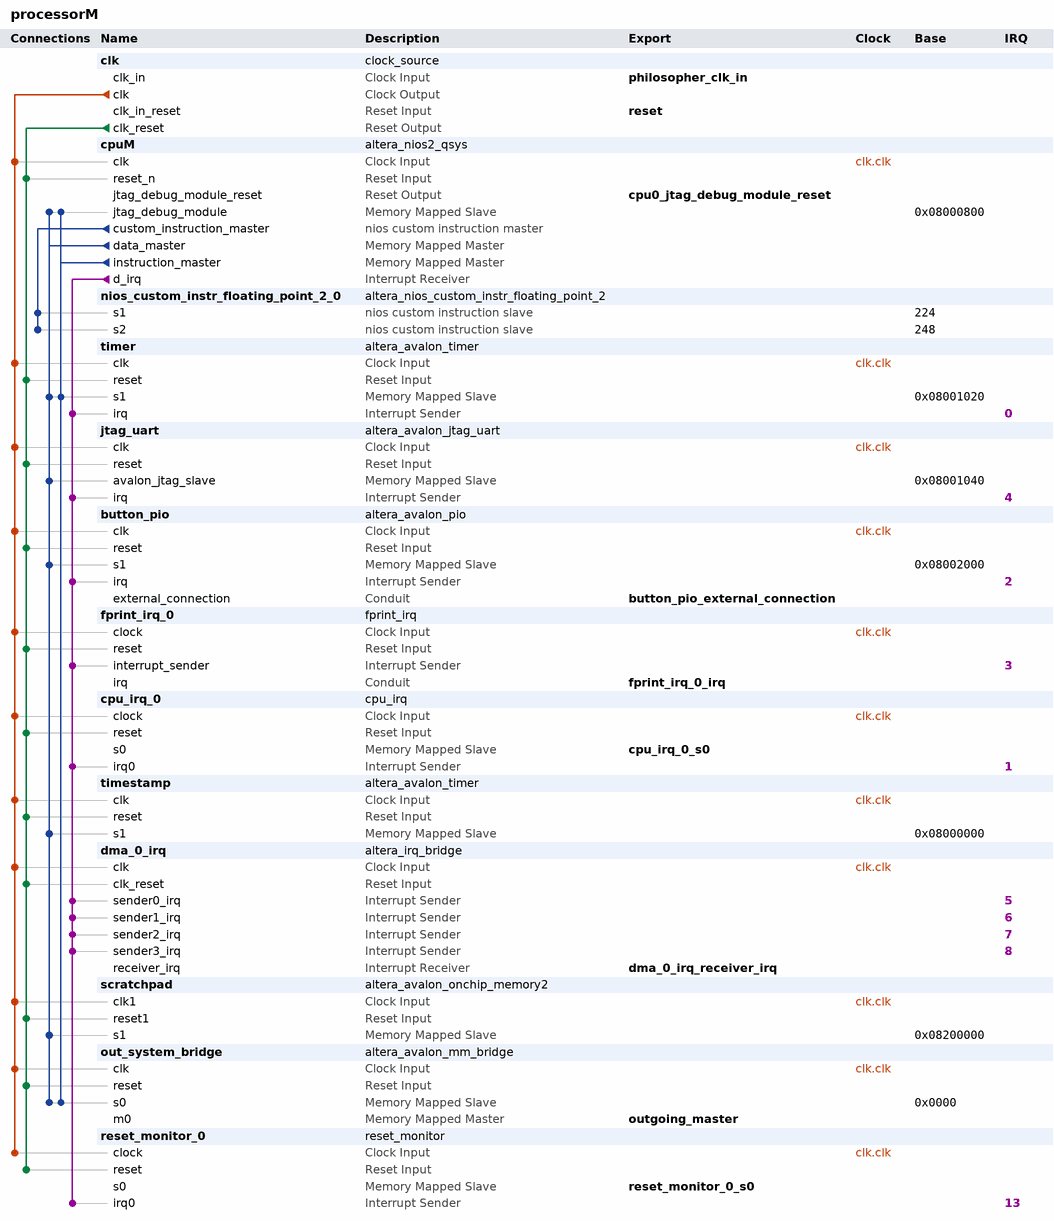
[diagram p0: system contents]
# Platform Designer (Qsys) system processorM, Arria V 5AGXFB3H4F35C5
# Parameters at their usual value, and those the tool derives, are not listed.
package require -exact qsys 13.1
create_system processorM
set_project_property DEVICE_FAMILY {Arria V}
set_project_property DEVICE 5AGXFB3H4F35C5

add_instance clk clock_source 13.1
set_instance_parameter_value clk clockFrequency 50000000

add_instance cpuM altera_nios2_qsys 13.1
set_instance_parameter_value cpuM mpu_enabled true
set_instance_parameter_value cpuM mpu_numOfDataRegion 16
set_instance_parameter_value cpuM resetOffset 4194304
set_instance_parameter_value cpuM exceptionOffset 4194336
set_instance_parameter_value cpuM cpuID 9
set_instance_parameter_value cpuM resetSlave Absolute
set_instance_parameter_value cpuM exceptionSlave Absolute
set_instance_parameter_value cpuM breakSlave cpuM.jtag_debug_module
set_instance_parameter_value cpuM muldiv_multiplierType NoneSmall
set_instance_parameter_value cpuM mpu_minDataRegionSize 10
set_instance_parameter_value cpuM impl Fast
set_instance_parameter_value cpuM icache_size 1024
set_instance_parameter_value cpuM dcache_size 0

add_instance nios_custom_instr_floating_point_2_0 altera_nios_custom_instr_floating_point_2 100.99.98.97

add_instance timer altera_avalon_timer 13.1
set_instance_parameter_value timer period 1
set_instance_parameter_value timer periodUnits MSEC

add_instance jtag_uart altera_avalon_jtag_uart 13.1
set_instance_parameter_value jtag_uart simInteractiveOptions INTERACTIVE_ASCII_OUTPUT

add_instance button_pio altera_avalon_pio 13.1
set_instance_parameter_value button_pio bitClearingEdgeCapReg true
set_instance_parameter_value button_pio captureEdge true
set_instance_parameter_value button_pio direction Input
set_instance_parameter_value button_pio generateIRQ true
set_instance_parameter_value button_pio irqType EDGE
set_instance_parameter_value button_pio width 1

add_instance fprint_irq_0 fprint_irq 1.0

add_instance cpu_irq_0 cpu_irq 1.0

add_instance timestamp altera_avalon_timer 13.1
set_instance_parameter_value timestamp counterSize 64
set_instance_parameter_value timestamp period 1
set_instance_parameter_value timestamp periodUnits MSEC

add_instance dma_0_irq altera_irq_bridge 13.1
set_instance_parameter_value dma_0_irq IRQ_WIDTH 4

add_instance scratchpad altera_avalon_onchip_memory2 13.1
set_instance_parameter_value scratchpad dataWidth 32
set_instance_parameter_value scratchpad dualPort false
set_instance_parameter_value scratchpad initMemContent true
set_instance_parameter_value scratchpad initializationFileName onchip_mem.hex
set_instance_parameter_value scratchpad memorySize 16384

add_instance out_system_bridge altera_avalon_mm_bridge 13.1
set_instance_parameter_value out_system_bridge DATA_WIDTH 32
set_instance_parameter_value out_system_bridge ADDRESS_WIDTH 27
set_instance_parameter_value out_system_bridge ADDRESS_UNITS SYMBOLS
set_instance_parameter_value out_system_bridge MAX_PENDING_RESPONSES 4

add_instance reset_monitor_0 reset_monitor 1.0

# connections
add_connection clk.clk button_pio.clk clock
add_connection clk.clk cpu_irq_0.clock clock
add_connection clk.clk cpuM.clk clock
add_connection clk.clk dma_0_irq.clk clock
add_connection clk.clk fprint_irq_0.clock clock
add_connection clk.clk jtag_uart.clk clock
add_connection clk.clk out_system_bridge.clk clock
add_connection clk.clk reset_monitor_0.clock clock
add_connection clk.clk scratchpad.clk1 clock
add_connection clk.clk timer.clk clock
add_connection clk.clk timestamp.clk clock
add_connection clk.clk_reset button_pio.reset reset
add_connection clk.clk_reset cpu_irq_0.reset reset
add_connection clk.clk_reset cpuM.reset_n reset
add_connection clk.clk_reset dma_0_irq.clk_reset reset
add_connection clk.clk_reset fprint_irq_0.reset reset
add_connection clk.clk_reset jtag_uart.reset reset
add_connection clk.clk_reset out_system_bridge.reset reset
add_connection clk.clk_reset reset_monitor_0.reset reset
add_connection clk.clk_reset scratchpad.reset1 reset
add_connection clk.clk_reset timer.reset reset
add_connection clk.clk_reset timestamp.reset reset
add_connection cpuM.data_master button_pio.s1 avalon
set_connection_parameter_value cpuM.data_master/button_pio.s1 baseAddress 0x08002000
add_connection cpuM.data_master cpuM.jtag_debug_module avalon
set_connection_parameter_value cpuM.data_master/cpuM.jtag_debug_module baseAddress 0x08000800
add_connection cpuM.data_master jtag_uart.avalon_jtag_slave avalon
set_connection_parameter_value cpuM.data_master/jtag_uart.avalon_jtag_slave baseAddress 0x08001040
add_connection cpuM.data_master out_system_bridge.s0 avalon
set_connection_parameter_value cpuM.data_master/out_system_bridge.s0 arbitrationPriority 8
set_connection_parameter_value cpuM.data_master/out_system_bridge.s0 baseAddress 0x0000
add_connection cpuM.data_master scratchpad.s1 avalon
set_connection_parameter_value cpuM.data_master/scratchpad.s1 baseAddress 0x08200000
add_connection cpuM.data_master timer.s1 avalon
set_connection_parameter_value cpuM.data_master/timer.s1 baseAddress 0x08001020
add_connection cpuM.data_master timestamp.s1 avalon
set_connection_parameter_value cpuM.data_master/timestamp.s1 baseAddress 0x08000000
add_connection cpuM.instruction_master cpuM.jtag_debug_module avalon
set_connection_parameter_value cpuM.instruction_master/cpuM.jtag_debug_module baseAddress 0x08000800
add_connection cpuM.instruction_master out_system_bridge.s0 avalon
set_connection_parameter_value cpuM.instruction_master/out_system_bridge.s0 arbitrationPriority 8
set_connection_parameter_value cpuM.instruction_master/out_system_bridge.s0 baseAddress 0x0000
add_connection cpuM.instruction_master timer.s1 avalon
set_connection_parameter_value cpuM.instruction_master/timer.s1 baseAddress 0x08001020
add_connection cpuM.d_irq button_pio.irq interrupt
set_connection_parameter_value cpuM.d_irq/button_pio.irq irqNumber 2
add_connection cpuM.d_irq cpu_irq_0.irq0 interrupt
set_connection_parameter_value cpuM.d_irq/cpu_irq_0.irq0 irqNumber 1
add_connection cpuM.d_irq dma_0_irq.sender0_irq interrupt
set_connection_parameter_value cpuM.d_irq/dma_0_irq.sender0_irq irqNumber 5
add_connection cpuM.d_irq dma_0_irq.sender1_irq interrupt
set_connection_parameter_value cpuM.d_irq/dma_0_irq.sender1_irq irqNumber 6
add_connection cpuM.d_irq dma_0_irq.sender2_irq interrupt
set_connection_parameter_value cpuM.d_irq/dma_0_irq.sender2_irq irqNumber 7
add_connection cpuM.d_irq dma_0_irq.sender3_irq interrupt
set_connection_parameter_value cpuM.d_irq/dma_0_irq.sender3_irq irqNumber 8
add_connection cpuM.d_irq fprint_irq_0.interrupt_sender interrupt
set_connection_parameter_value cpuM.d_irq/fprint_irq_0.interrupt_sender irqNumber 3
add_connection cpuM.d_irq jtag_uart.irq interrupt
set_connection_parameter_value cpuM.d_irq/jtag_uart.irq irqNumber 4
add_connection cpuM.d_irq reset_monitor_0.irq0 interrupt
set_connection_parameter_value cpuM.d_irq/reset_monitor_0.irq0 irqNumber 13
add_connection cpuM.d_irq timer.irq interrupt
set_connection_parameter_value cpuM.d_irq/timer.irq irqNumber 0
add_connection cpuM.custom_instruction_master nios_custom_instr_floating_point_2_0.s1 nios_custom_instruction
set_connection_parameter_value cpuM.custom_instruction_master/nios_custom_instr_floating_point_2_0.s1 CIName nios_custom_instr_floating_point_2_0
set_connection_parameter_value cpuM.custom_instruction_master/nios_custom_instr_floating_point_2_0.s1 baseAddress 224
add_connection cpuM.custom_instruction_master nios_custom_instr_floating_point_2_0.s2 nios_custom_instruction
set_connection_parameter_value cpuM.custom_instruction_master/nios_custom_instr_floating_point_2_0.s2 CIName nios_custom_instr_floating_point_2_0_1
set_connection_parameter_value cpuM.custom_instruction_master/nios_custom_instr_floating_point_2_0.s2 baseAddress 248

# exported interfaces
add_interface philosopher_clk_in clock sink
set_interface_property philosopher_clk_in EXPORT_OF clk.clk_in
add_interface outgoing_master avalon master
set_interface_property outgoing_master EXPORT_OF out_system_bridge.m0
add_interface button_pio_external_connection conduit end
set_interface_property button_pio_external_connection EXPORT_OF button_pio.external_connection
add_interface cpu0_jtag_debug_module_reset reset source
set_interface_property cpu0_jtag_debug_module_reset EXPORT_OF cpuM.jtag_debug_module_reset
add_interface reset reset sink
set_interface_property reset EXPORT_OF clk.clk_in_reset
add_interface fprint_irq_0_irq conduit end
set_interface_property fprint_irq_0_irq EXPORT_OF fprint_irq_0.irq
add_interface cpu_irq_0_s0 avalon slave
set_interface_property cpu_irq_0_s0 EXPORT_OF cpu_irq_0.s0
add_interface reset_monitor_0_s0 avalon slave
set_interface_property reset_monitor_0_s0 EXPORT_OF reset_monitor_0.s0
add_interface dma_0_irq_receiver_irq interrupt receiver
set_interface_property dma_0_irq_receiver_irq EXPORT_OF dma_0_irq.receiver_irq

set_interconnect_requirement {$system} qsys_mm.clockCrossingAdapter HANDSHAKE
set_interconnect_requirement {$system} qsys_mm.maxAdditionalLatency 1

save_system processorM.qsys
